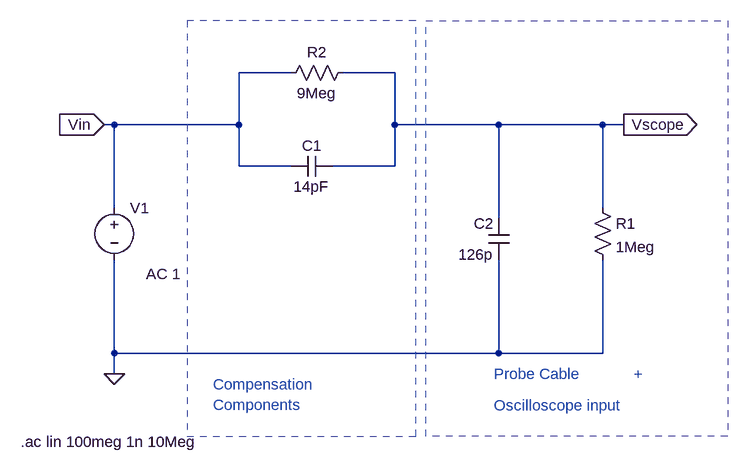
[diagram p0: schematic Probe Compensation.asc]
Probe Compensation.asc, the LTspice schematic file:
Version 4
SHEET 1 1908 680
WIRE 320 -80 240 -80
WIRE 480 -80 400 -80
WIRE 48 0 32 0
WIRE 240 0 240 -80
WIRE 240 0 48 0
WIRE 480 0 480 -80
WIRE 640 0 480 0
WIRE 800 0 640 0
WIRE 832 0 800 0
WIRE 240 64 240 0
WIRE 320 64 240 64
WIRE 480 64 480 0
WIRE 480 64 384 64
WIRE 48 128 48 0
WIRE 800 128 800 0
WIRE 640 144 640 0
WIRE 48 352 48 208
WIRE 640 352 640 208
WIRE 640 352 48 352
WIRE 800 352 800 208
WIRE 800 352 640 352
WIRE 48 384 48 352
FLAG 48 384 0
FLAG 832 0 Vscope
IOPIN 832 0 Out
FLAG 32 0 Vin
IOPIN 32 0 In
SYMBOL voltage 48 112 R0
WINDOW 3 102 118 Right 2
WINDOW 123 0 0 Left 0
WINDOW 39 0 0 Left 0
SYMATTR Value AC 1
SYMATTR InstName V1
SYMBOL res 784 112 R0
SYMATTR InstName R1
SYMATTR Value 1Meg
SYMBOL res 416 -96 R90
WINDOW 0 0 56 VBottom 2
WINDOW 3 32 56 VTop 2
SYMATTR InstName R2
SYMATTR Value 9Meg
SYMBOL cap 656 208 R180
WINDOW 0 24 56 Left 2
WINDOW 3 24 8 Left 2
SYMATTR InstName C2
SYMATTR Value 126p
SYMBOL cap 384 48 R90
WINDOW 0 0 32 VBottom 2
WINDOW 3 32 32 VTop 2
SYMATTR InstName C1
SYMATTR Value 14pF
TEXT 632 432 Left 2 ;Oscilloscope input
TEXT 632 384 Left 2 ;Probe Cable
TEXT 200 400 Left 2 ;Compensation\nComponents
TEXT 848 384 Left 2 ;+
TEXT -96 488 Left 2 !.ac lin 100meg 1n 10Meg
RECTANGLE Normal 160 480 512 -160 2
RECTANGLE Normal 992 480 528 -160 2

The netlist it stands for:
* Probe Compensation.asc
V1 Vin 0 AC 1
R1 Vscope 0 1Meg
R2 Vscope Vin 9Meg
C2 0 Vscope 126p
C1 Vscope Vin 14pF
* Oscilloscope input
* Probe Cable
* Compensation
* Components
* +
.ac lin 100meg 1n 10Meg
.backanno
.end